# Altium schematic sheet 18f4550.SchDoc
size A4
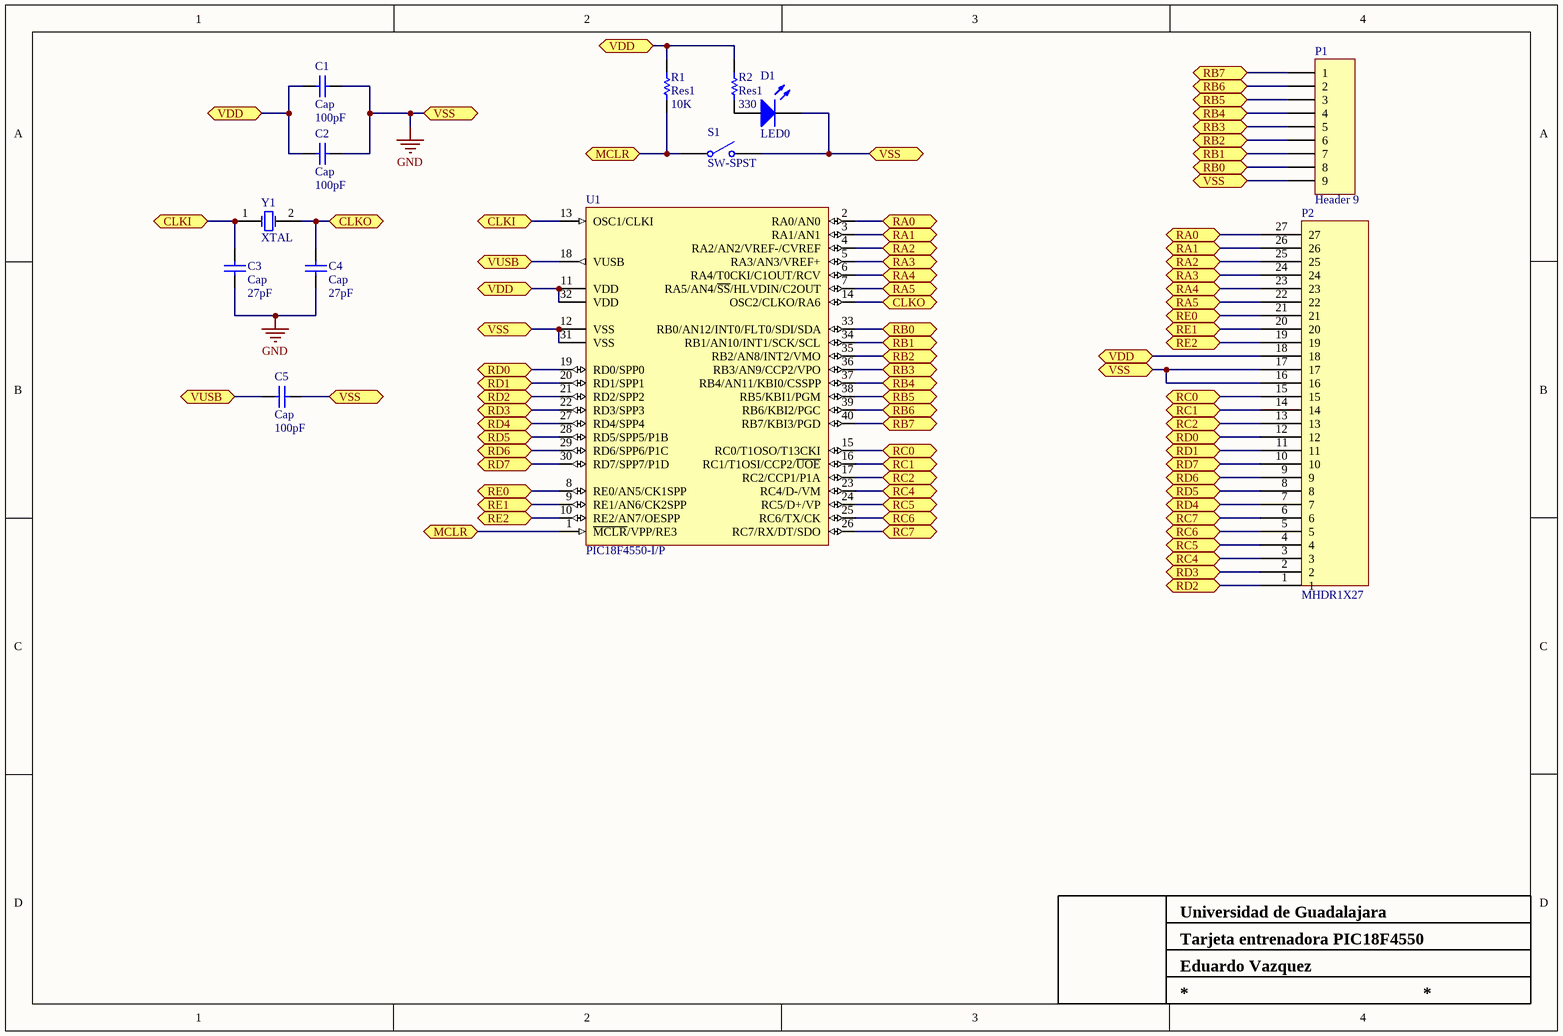
[diagram p0: 18f4550.SchDoc]

## Parts
C1  Cap  value 100pF  [CAP-CER1]
C2  Cap  value 100pF  [CAP-CER1]
C3  Cap  value 27pF  [CAP-CER2]
C4  Cap  value 27pF  [CAP-CER2]
C5  Cap  value 100pF  [CAP-CER1]
D1  LED0  [LED-3MM]
P1  Header 9  [HDR1X9]
P2  MHDR1X27  [MHDR1X27]
R1  Res1  value 10K  [AXIAL-0.3]
R2  Res1  value 330  [AXIAL-0.3]
S1  SW-SPST  [SW-SPST-SIL]
U1  PIC18F4550-I/P  [4550]
Y1  XTAL  [XTAL]

## Ports
CLKI, CLKO, MCLR, RA0, RA1, RA2, RA3, RA4, RA5, RB0, RB1, RB2, RB3, RB4, RB5, RB6, RB7, RC0, RC1, RC2, RC4, RC5, RC6, RC7, RD0, RD1, RD2, RD3, RD4, RD5, RD6, RD7, RE0, RE1, RE2, VDD, VSS, VUSB

## Nets
GND: C1.2 C2.2 C3.2 C4.2 C5.2 D1.2(K) P1.9 P2.16 P2.17 S1.2(NO) U1.12(VSS) U1.31(VSS) ; port VSS
CLKI: C3.1 U1.13(OSC1/CLKI) Y1.1(OSC1) ; port CLKI
CLKO: C4.1 U1.14(OSC2/CLKO/RA6) Y1.2(OSC2) ; port CLKO
MCLR: R1.1 S1.1(COMMON) U1.1(~{MCLR}/VPP/RE3) ; port MCLR
RA0: P2.27 U1.2(RA0/AN0) ; port RA0
RA1: P2.26 U1.3(RA1/AN1) ; port RA1
RA2: P2.25 U1.4(RA2/AN2/VREF-/CVREF) ; port RA2
RA3: P2.24 U1.5(RA3/AN3/VREF+) ; port RA3
RA4: P2.23 U1.6(RA4/T0CKI/C1OUT/RCV) ; port RA4
RA5: P2.22 U1.7(RA5/AN4/~{SS}/HLVDIN/C2OUT) ; port RA5
RB0: P1.8 U1.33(RB0/AN12/INT0/FLT0/SDI/SDA) ; port RB0
RB1: P1.7 U1.34(RB1/AN10/INT1/SCK/SCL) ; port RB1
RB2: P1.6 U1.35(RB2/AN8/INT2/VMO) ; port RB2
RB3: P1.5 U1.36(RB3/AN9/CCP2/VPO) ; port RB3
RB4: P1.4 U1.37(RB4/AN11/KBI0/CSSPP) ; port RB4
RB5: P1.3 U1.38(RB5/KBI1/PGM) ; port RB5
RB6: P1.2 U1.39(RB6/KBI2/PGC) ; port RB6
RB7: P1.1 U1.40(RB7/KBI3/PGD) ; port RB7
RC0: P2.15 U1.15(RC0/T1OSO/T13CKI) ; port RC0
RC1: P2.14 U1.16(RC1/T1OSI/CCP2/~{UOE}) ; port RC1
RC2: P2.13 U1.17(RC2/CCP1/P1A) ; port RC2
RC4: P2.3 U1.23(RC4/D-/VM) ; port RC4
RC5: P2.4 U1.24(RC5/D+/VP) ; port RC5
RC6: P2.5 U1.25(RC6/TX/CK) ; port RC6
RC7: P2.6 U1.26(RC7/RX/DT/SDO) ; port RC7
RD0: P2.12 U1.19(RD0/SPP0) ; port RD0
RD1: P2.11 U1.20(RD1/SPP1) ; port RD1
RD2: P2.1 U1.21(RD2/SPP2) ; port RD2
RD3: P2.2 U1.22(RD3/SPP3) ; port RD3
RD4: P2.7 U1.27(RD4/SPP4) ; port RD4
RD5: P2.8 U1.28(RD5/SPP5/P1B) ; port RD5
RD6: P2.9 U1.29(RD6/SPP6/P1C) ; port RD6
RD7: P2.10 U1.30(RD7/SPP7/P1D) ; port RD7
RE0: P2.21 U1.8(RE0/AN5/CK1SPP) ; port RE0
RE1: P2.20 U1.9(RE1/AN6/CK2SPP) ; port RE1
RE2: P2.19 U1.10(RE2/AN7/OESPP) ; port RE2
VDD: C1.1 C2.1 P2.18 R1.2 R2.2 U1.11(VDD) U1.32(VDD) ; port VDD
VUSB: C5.1 U1.18(VUSB) ; port VUSB
NetD1_1: D1.1(A) R2.1

## Notes on the sheet
- Tarjeta entrenadora PIC18F4550
- Universidad de Guadalajara
- Eduardo Vazquez

## Library data of the parts
C1-C5 = Cap: Capacitor; Published: 8-Jun-2000; LatestRevisionDate: 17-Jul-2002; LatestRevisionNote: Re-released for DXP Platform.; PackageReference: RAD-0.3; Publisher: Altium Limited; PackageDescription: Radial Cap, Thru-Hole; 2 Leads; 0.3 in Pin Spacing
D1 = LED0: Typical INFRARED GaAs LED; Published: 8-Jun-2000; LatestRevisionDate: 08-Jul-2005; LatestRevisionNote: Mech Layer 1 removed.; PackageReference: LED-0; Publisher: Altium Limited; PackageDescription: LED; 2 Leads
P1 = Header 9: Header, 9-Pin; LatestRevisionDate: 17-Jul-2002; LatestRevisionNote: Re-released for DXP Platform.; Publisher: Altium Limited
R1 R2 = Res1: Resistor; Published: 8-Jun-2000; LatestRevisionDate: 17-Jul-2002; LatestRevisionNote: Re-released for DXP Platform.; PackageReference: AXIAL-0.3; Publisher: Altium Limited; PackageDescription: Axial Device, Thru-Hole; 2 Leads; 0.3 in Pin Spacing
S1 = SW-SPST: Single-Pole, Single-Throw Switch; Published: 24-Mar-1999; LatestRevisionDate: 17-Jul-2002; LatestRevisionNote: Re-released for DXP Platform.; PackageReference: SPST-2; Publisher: Altium Limited; PackageDescription: Switch; 2 Leads
U1 = PIC18F4550-I/P: High Performance, Enhanced Flash, USB Microcontroller with nanoWatt Technology, 32K Flash, 40-Pin PDIP, Industrial Temperature Range; Published: 29-Jan-2009; LatestRevisionDate: 02-Dec-2009; LatestRevisionNote: Updated to datasheet revision E, Aug-2008; DatasheetVersion: revE, Aug-2008; PackageVersion: revBB, Aug-2009; PackageReference: PDIP600-P40; Publisher: Altium Limited; PackageDescription: 40-Lead Plastic Dual In-Line (P) - 600 mil Body [PDIP]; Supplier 1: Digi-Key; Supplier Part Number 1: PIC18F4550-I/P-ND; Supplier 2: Farnell; Supplier Part Number 2: 1660062; Supplier 3: Farnell; Supplier Part Number 3: 9321357; ComponentLink1Description: Datasheet; ComponentLink1URL: http://ww1.microchip.com/downloads/en/DeviceDoc/39632e.pdf; ComponentLink2Description: Packaging Specification; ComponentLink2URL: http://www.microchip.com/stellent/groups/techpub_sg/documents/packagingspec/en012702.pdf; ComponentLink3Description: Microchip.com Home; ComponentLink3URL: http://www.microchip.com/
Y1 = XTAL: Crystal Oscillator; Published: 8-Jun-2000; LatestRevisionDate: 17-Jul-2002; LatestRevisionNote: Re-released for DXP Platform.; PackageReference: R38; Publisher: Altium Limited; PackageDescription: Crystal, Thru-Hole; 2 Leads; Body 3.1 x 8.2 mm (Dia.xH)